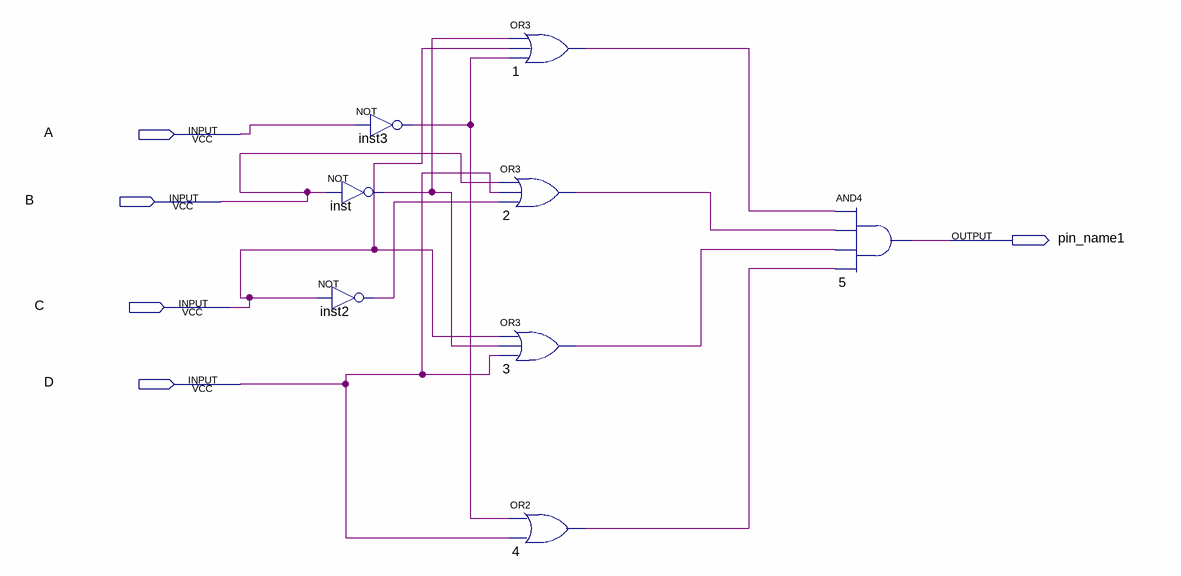
[diagram p0: schematic sheet]
// Quartus schematic prime_number.bdf as structural Verilog: 8 symbols, 5 pins
module prime_number (
  input  A,
  input  B,
  input  C,
  input  D,
  output pin_name1
);

  wire inst2_out, inst3_out, inst_out, n1_out, n2_out, n3_out, n4_out;

  not inst (inst_out, B);
  not inst2 (inst2_out, C);
  not inst3 (inst3_out, A);
  or u_1 (n1_out, inst_out, C, inst3_out);
  or u_2 (n2_out, B, D, inst2_out);
  or u_3 (n3_out, C, inst_out, D);
  or u_4 (n4_out, inst3_out, D);
  and u_5 (pin_name1, n1_out, n2_out, n3_out, n4_out);
endmodule
